# Altium schematic sheet hdb44_passthrough.SchDoc
size C; SheetNumber: 1; SheetTotal: 1
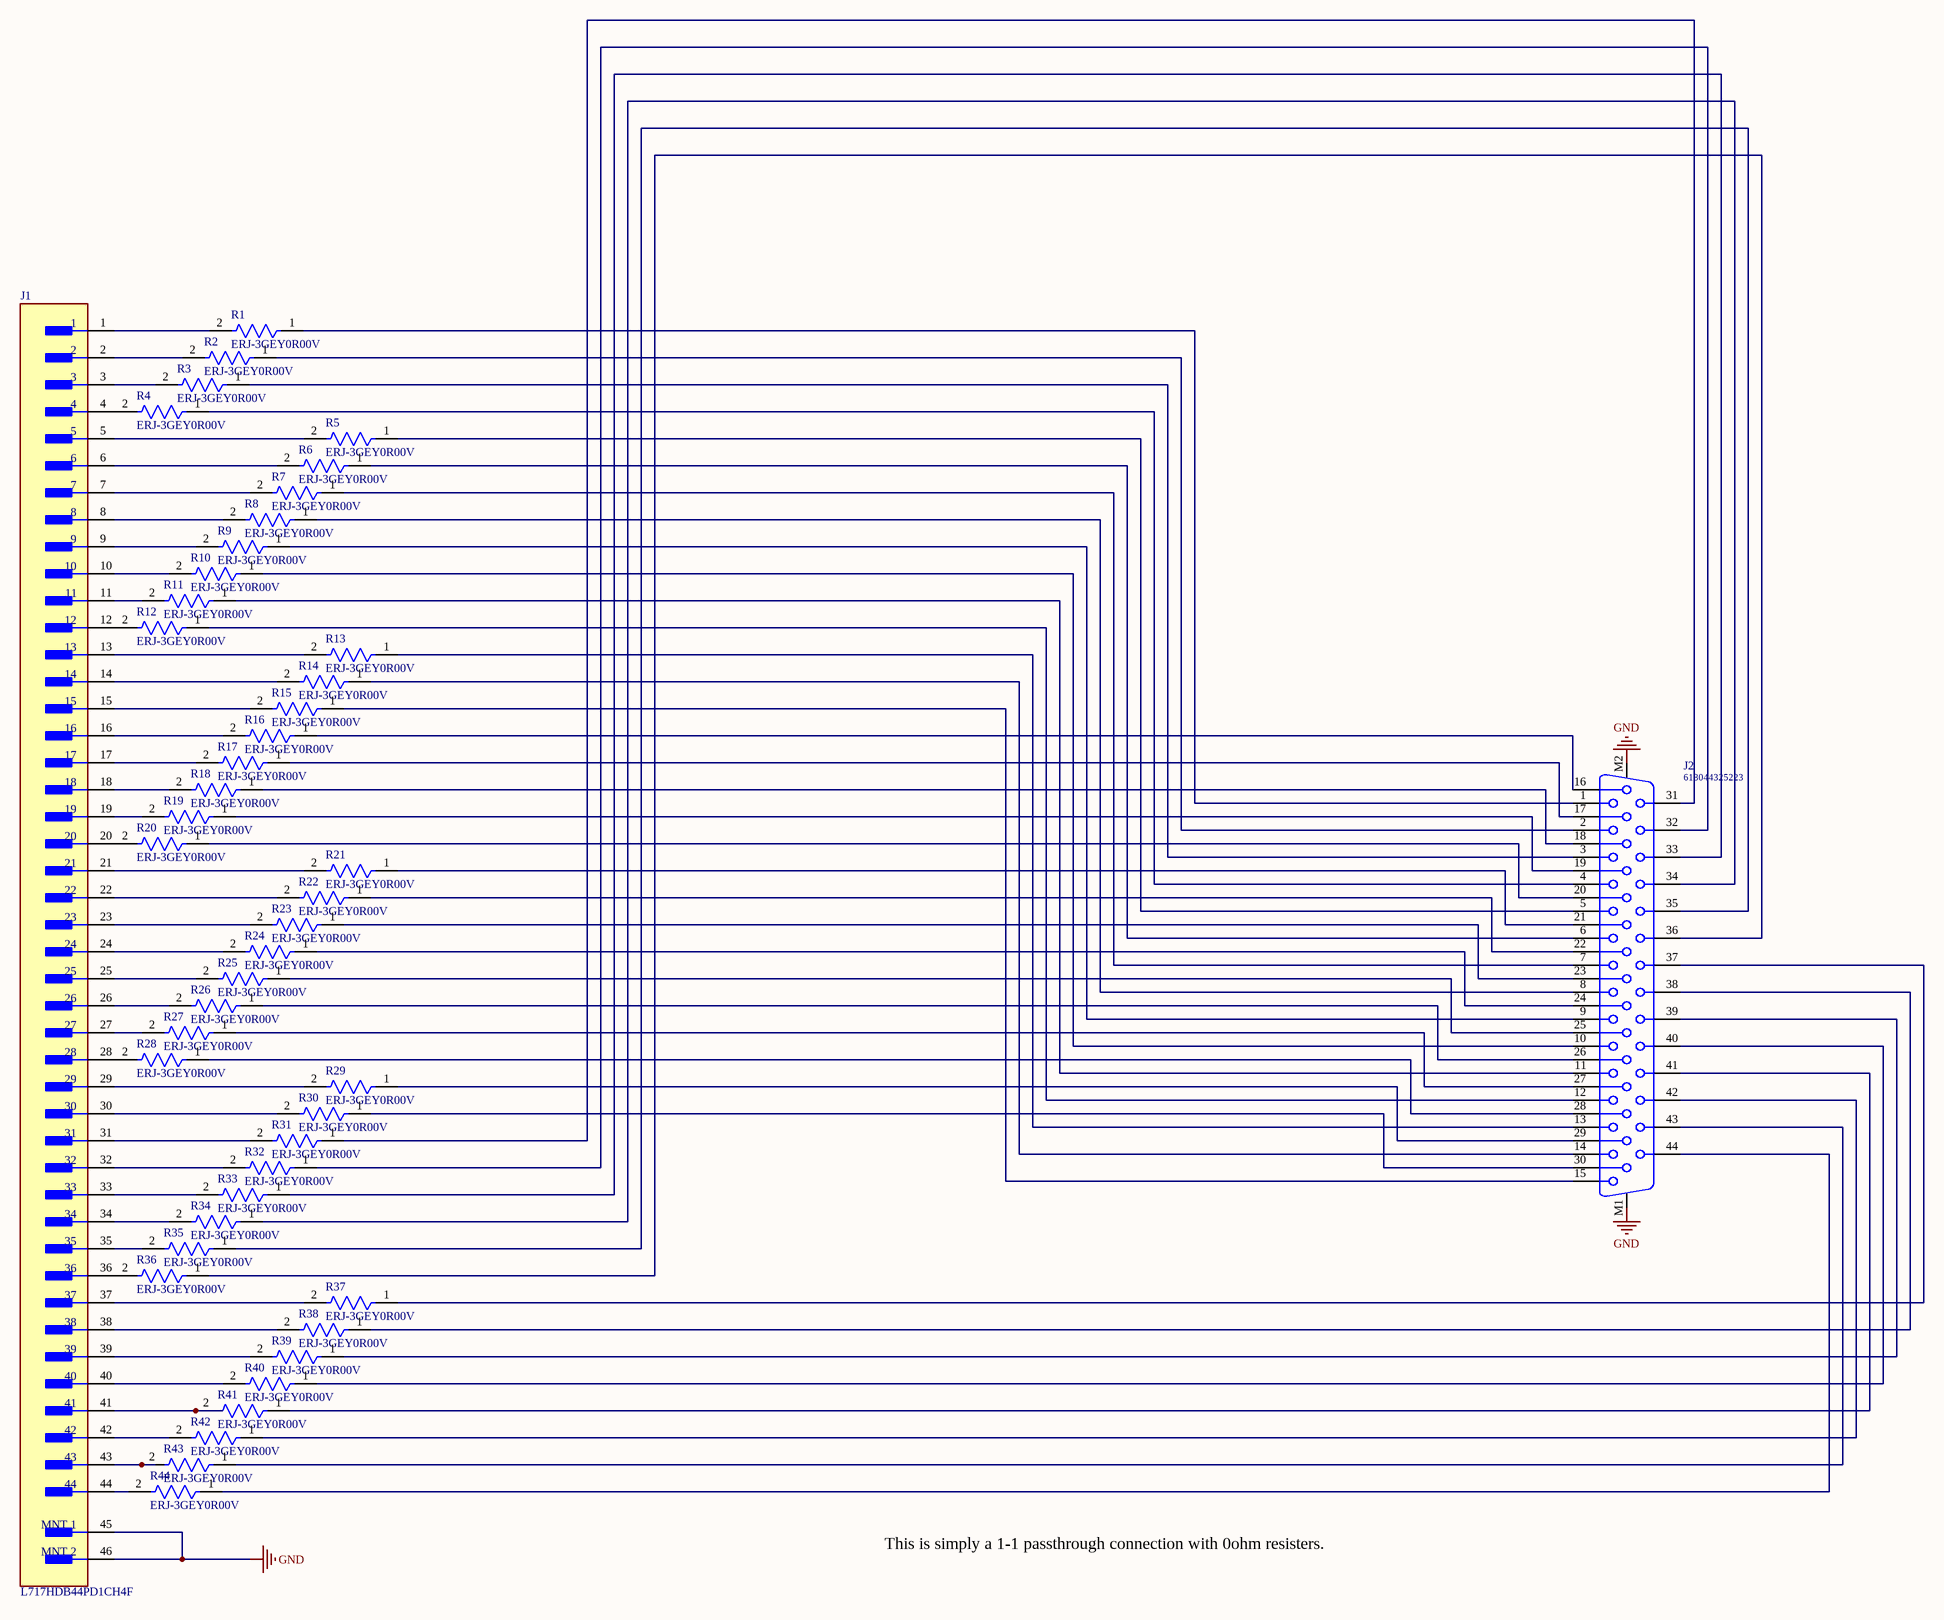
[diagram p0: hdb44_passthrough.SchDoc]

## Parts
J1  L717HDB44PD1CH4F  [FP-L717HDB44PD1CH4F-MFG]
J2  618044325223  [618044325223]
R1  ERJ-3GEY0R00V  [FP-ERJ-3GEY0R00V-MFG]
R2  ERJ-3GEY0R00V  [FP-ERJ-3GEY0R00V-MFG]
R3  ERJ-3GEY0R00V  [FP-ERJ-3GEY0R00V-MFG]
R4  ERJ-3GEY0R00V  [FP-ERJ-3GEY0R00V-MFG]
R5  ERJ-3GEY0R00V  [FP-ERJ-3GEY0R00V-MFG]
R6  ERJ-3GEY0R00V  [FP-ERJ-3GEY0R00V-MFG]
R7  ERJ-3GEY0R00V  [FP-ERJ-3GEY0R00V-MFG]
R8  ERJ-3GEY0R00V  [FP-ERJ-3GEY0R00V-MFG]
R9  ERJ-3GEY0R00V  [FP-ERJ-3GEY0R00V-MFG]
R10  ERJ-3GEY0R00V  [FP-ERJ-3GEY0R00V-MFG]
R11  ERJ-3GEY0R00V  [FP-ERJ-3GEY0R00V-MFG]
R12  ERJ-3GEY0R00V  [FP-ERJ-3GEY0R00V-MFG]
R13  ERJ-3GEY0R00V  [FP-ERJ-3GEY0R00V-MFG]
R14  ERJ-3GEY0R00V  [FP-ERJ-3GEY0R00V-MFG]
R15  ERJ-3GEY0R00V  [FP-ERJ-3GEY0R00V-MFG]
R16  ERJ-3GEY0R00V  [FP-ERJ-3GEY0R00V-MFG]
R17  ERJ-3GEY0R00V  [FP-ERJ-3GEY0R00V-MFG]
R18  ERJ-3GEY0R00V  [FP-ERJ-3GEY0R00V-MFG]
R19  ERJ-3GEY0R00V  [FP-ERJ-3GEY0R00V-MFG]
R20  ERJ-3GEY0R00V  [FP-ERJ-3GEY0R00V-MFG]
R21  ERJ-3GEY0R00V  [FP-ERJ-3GEY0R00V-MFG]
R22  ERJ-3GEY0R00V  [FP-ERJ-3GEY0R00V-MFG]
R23  ERJ-3GEY0R00V  [FP-ERJ-3GEY0R00V-MFG]
R24  ERJ-3GEY0R00V  [FP-ERJ-3GEY0R00V-MFG]
R25  ERJ-3GEY0R00V  [FP-ERJ-3GEY0R00V-MFG]
R26  ERJ-3GEY0R00V  [FP-ERJ-3GEY0R00V-MFG]
R27  ERJ-3GEY0R00V  [FP-ERJ-3GEY0R00V-MFG]
R28  ERJ-3GEY0R00V  [FP-ERJ-3GEY0R00V-MFG]
R29  ERJ-3GEY0R00V  [FP-ERJ-3GEY0R00V-MFG]
R30  ERJ-3GEY0R00V  [FP-ERJ-3GEY0R00V-MFG]
R31  ERJ-3GEY0R00V  [FP-ERJ-3GEY0R00V-MFG]
R32  ERJ-3GEY0R00V  [FP-ERJ-3GEY0R00V-MFG]
R33  ERJ-3GEY0R00V  [FP-ERJ-3GEY0R00V-MFG]
R34  ERJ-3GEY0R00V  [FP-ERJ-3GEY0R00V-MFG]
R35  ERJ-3GEY0R00V  [FP-ERJ-3GEY0R00V-MFG]
R36  ERJ-3GEY0R00V  [FP-ERJ-3GEY0R00V-MFG]
R37  ERJ-3GEY0R00V  [FP-ERJ-3GEY0R00V-MFG]
R38  ERJ-3GEY0R00V  [FP-ERJ-3GEY0R00V-MFG]
R39  ERJ-3GEY0R00V  [FP-ERJ-3GEY0R00V-MFG]
R40  ERJ-3GEY0R00V  [FP-ERJ-3GEY0R00V-MFG]
R41  ERJ-3GEY0R00V  [FP-ERJ-3GEY0R00V-MFG]
R42  ERJ-3GEY0R00V  [FP-ERJ-3GEY0R00V-MFG]
R43  ERJ-3GEY0R00V  [FP-ERJ-3GEY0R00V-MFG]
R44  ERJ-3GEY0R00V  [FP-ERJ-3GEY0R00V-MFG]

## Nets
GND: J1.45(MNT_1) J1.46(MNT_2) J2.M1 J2.M2
NetJ1_1: J1.1 R1.2
NetJ1_2: J1.2 R2.2
NetJ1_3: J1.3 R3.2
NetJ1_4: J1.4 R4.2
NetJ1_5: J1.5 R5.2
NetJ1_6: J1.6 R6.2
NetJ1_7: J1.7 R7.2
NetJ1_8: J1.8 R8.2
NetJ1_9: J1.9 R9.2
NetJ1_10: J1.10 R10.2
NetJ1_11: J1.11 R11.2
NetJ1_12: J1.12 R12.2
NetJ1_13: J1.13 R13.2
NetJ1_14: J1.14 R14.2
NetJ1_15: J1.15 R15.2
NetJ1_16: J1.16 R16.2
NetJ1_17: J1.17 R17.2
NetJ1_18: J1.18 R18.2
NetJ1_19: J1.19 R19.2
NetJ1_20: J1.20 R20.2
NetJ1_21: J1.21 R21.2
NetJ1_22: J1.22 R22.2
NetJ1_23: J1.23 R23.2
NetJ1_24: J1.24 R24.2
NetJ1_25: J1.25 R25.2
NetJ1_26: J1.26 R26.2
NetJ1_27: J1.27 R27.2
NetJ1_28: J1.28 R28.2
NetJ1_29: J1.29 R29.2
NetJ1_30: J1.30 R30.2
NetJ1_31: J1.31 R31.2
NetJ1_32: J1.32 R32.2
NetJ1_33: J1.33 R33.2
NetJ1_34: J1.34 R34.2
NetJ1_35: J1.35 R35.2
NetJ1_36: J1.36 R36.2
NetJ1_37: J1.37 R37.2
NetJ1_38: J1.38 R38.2
NetJ1_39: J1.39 R39.2
NetJ1_40: J1.40 R40.2
NetJ1_41: J1.41 R41.2
NetJ1_42: J1.42 R42.2
NetJ1_43: J1.43 R43.2
NetJ1_44: J1.44 R44.2
NetJ2_1: J2.1 R1.1
NetJ2_2: J2.2 R2.1
NetJ2_3: J2.3 R3.1
NetJ2_4: J2.4 R4.1
NetJ2_5: J2.5 R5.1
NetJ2_6: J2.6 R6.1
NetJ2_7: J2.7 R7.1
NetJ2_8: J2.8 R8.1
NetJ2_9: J2.9 R9.1
NetJ2_10: J2.10 R10.1
NetJ2_11: J2.11 R11.1
NetJ2_12: J2.12 R12.1
NetJ2_13: J2.13 R13.1
NetJ2_14: J2.14 R14.1
NetJ2_15: J2.15 R15.1
NetJ2_16: J2.16 R16.1
NetJ2_17: J2.17 R17.1
NetJ2_18: J2.18 R18.1
NetJ2_19: J2.19 R19.1
NetJ2_20: J2.20 R20.1
NetJ2_21: J2.21 R21.1
NetJ2_22: J2.22 R22.1
NetJ2_23: J2.23 R23.1
NetJ2_24: J2.24 R24.1
NetJ2_25: J2.25 R25.1
NetJ2_26: J2.26 R26.1
NetJ2_27: J2.27 R27.1
NetJ2_28: J2.28 R28.1
NetJ2_29: J2.29 R29.1
NetJ2_30: J2.30 R30.1
NetJ2_31: J2.31 R31.1
NetJ2_32: J2.32 R32.1
NetJ2_33: J2.33 R33.1
NetJ2_34: J2.34 R34.1
NetJ2_35: J2.35 R35.1
NetJ2_36: J2.36 R36.1
NetJ2_37: J2.37 R37.1
NetJ2_38: J2.38 R38.1
NetJ2_39: J2.39 R39.1
NetJ2_40: J2.40 R40.1
NetJ2_41: J2.41 R41.1
NetJ2_42: J2.42 R42.1
NetJ2_43: J2.43 R43.1
NetJ2_44: J2.44 R44.1

## Notes on the sheet
- This is simply a 1-1 passthrough connection with 0ohm resisters.

## Library data of the parts
J1 = CMP-02362-000001-1: CONN DSUB HD PLUG 44POS R/A SLDR; Current Rating: 3A; Body Material: Steel; Number of Contacts: 44; Connector Type: D-Sub; Number of Ports: 1; Gender: Male; Voltage Rating: 250V; Width: 12.55mm; Contact Plating: Gold; Max Operating Temperature: 105°C; Number of Terminals: 44; Length: 53.09mm; Number of Rows: 3; Number of Positions: 44; Min Operating Temperature: -55°C; Orientation: Right Angle; Packaging: Tray; Package Quantity: 50; Termination: Solder; Depth: 22.22mm; Housing Material: Thermoplastic; Mount: Through Hole; Contact Material: Brass
J2 = CMP-1502-00222-1: Female High Density PCB Connector without Hex Screw WR-DSUB, Angled, 44 pins; Manufacturer: Wurth Elektronik; Pin Number: 44; Contact Resistance: 30mOhm; Rated Current: 3A; Working Voltage: 60VAC; Packaging: Tray; Gender: Female; Package Reference: 618044325223; Mounting Technology: THT; Publisher: WurthElektronik; Datasheet URL: https://katalog.we-online.de/em/datasheet/6180xx325223.pdf; Part Number: 618044325223; Manufacturer URL: http://www.we-online.de; Operating Temperature: -40to85degC; Orientation: Angled
R1-R44 = CMP-2000-00700-2: RES SMD 0 OHM JUMPER 1/10W 0603; Manufacturer: Panasonic; Tolerance: 5%; Automotive Grade: Grade 0; Voltage Rating: 75V; Value: 0Ω; Temperature Coefficient: -100/+600ppm/°C; Power Rating: 0.1W; Mouser Description: Resistor, Chip Thick Film, 0 Ohm, 0.1w, Resistor, Chip Thick Film, 0 Ohm, 0.1w, 5%; Manufacturer Part Number: ERJ-3GEY0R00V; Ipc Land Pattern Name: RESC16080X45; Category: Res; Package: 0603; Temperature: -55°C to +155°C; Temperature Range Low: -55°C; Series: ERJ; Resistance: 0Ω; RoHS: TRUE; Composition: Thick Film; Octopart: https://octopart.com/erj-3gey0r00v-panasonic-55389238; Device Class L1: Passive Components; Footprint Url: https://industrial.panasonic.com/cdbs/www-data/pdf/RDA0000/DMA0000COL17.pdf; ComponentLink2Description: Datasheet; Device Class L2: Resistors; Temperature Range High: +155°C; Digikey Description: RES SMD 0 OHM JUMPER 1/10W 0603; Lead Free: Yes; Device Class L3: Chip SMD Resistors; Height: 0.55mm; ComponentLink2URL: https://industrial.panasonic.com/cdbs/www-data/pdf/RDA0000/AOA0000C301.pdf; Automotive: Yes